# Altium schematic sheet Power_Supply_ZynqXC7Z010.SchDoc
size A4; SheetNumber: 5; SheetTotal: 5
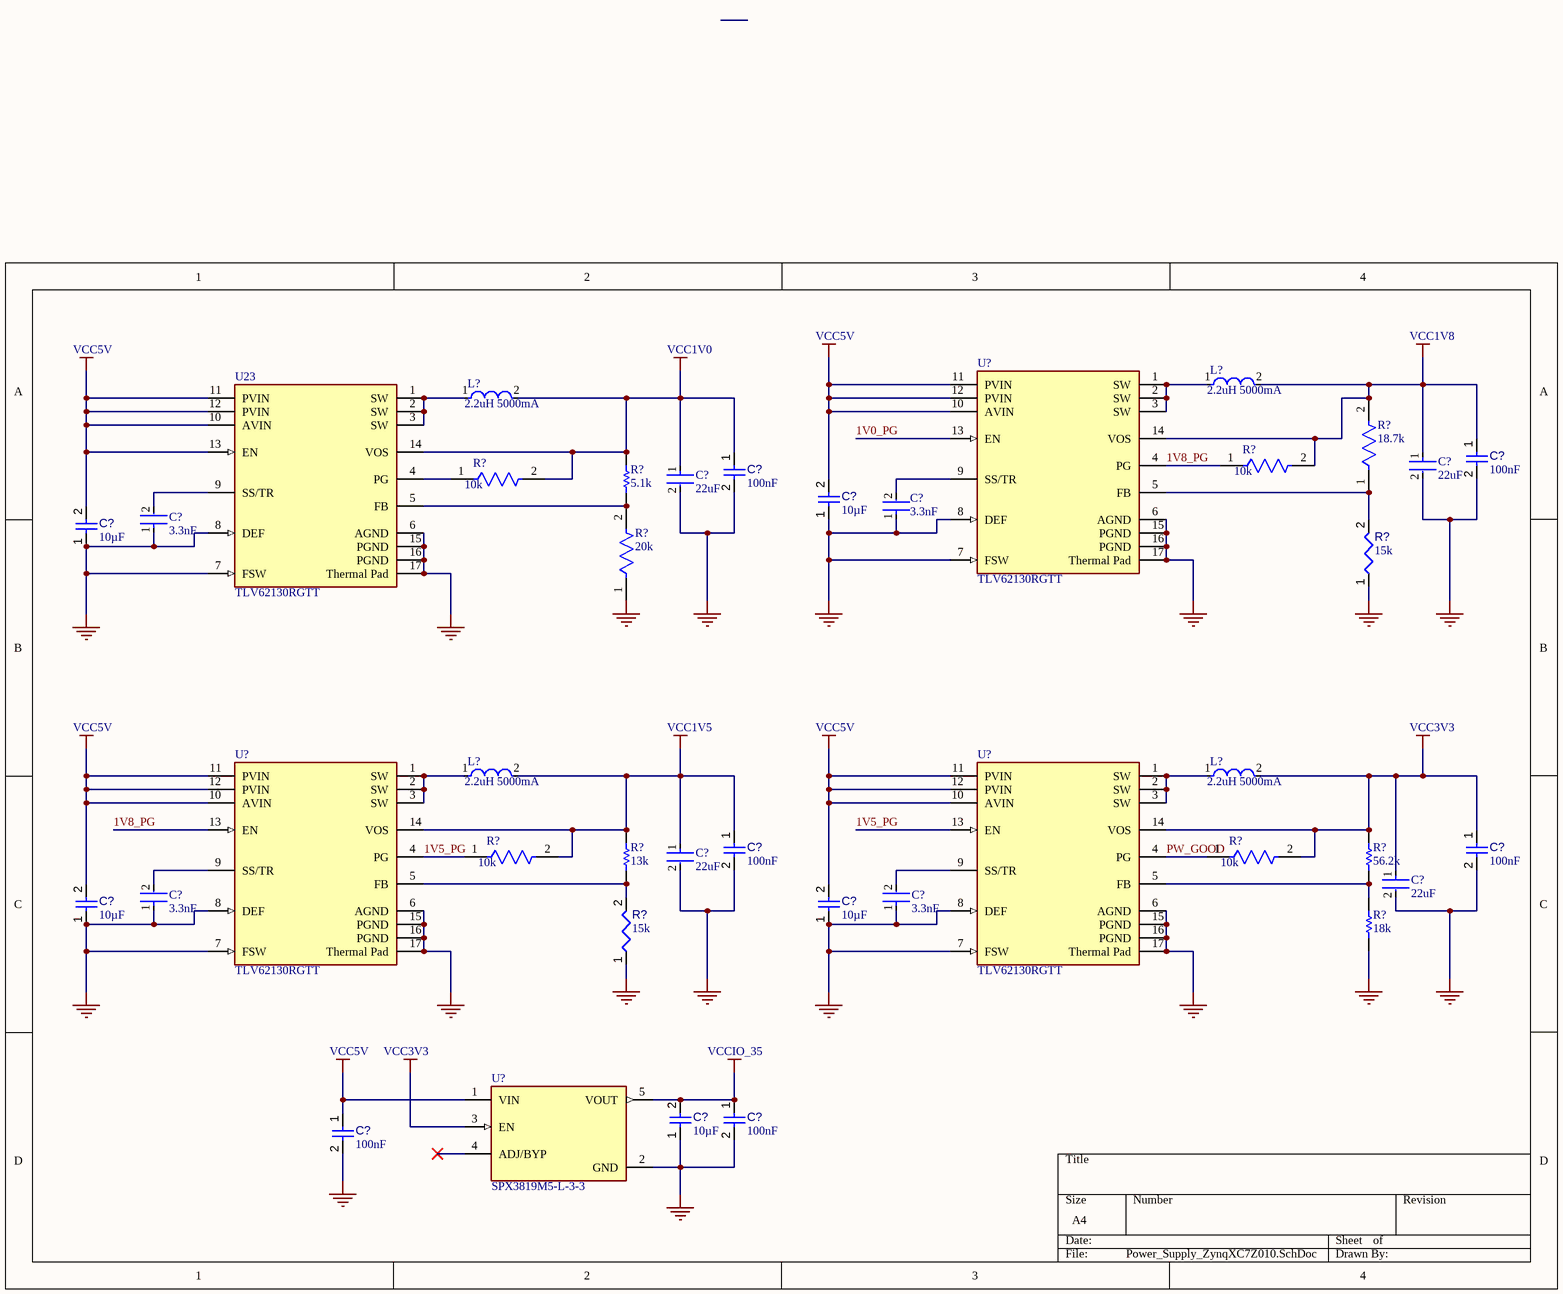
[diagram p0: Power_Supply_ZynqXC7Z010.SchDoc]

## Parts
(Parts that share a designator on the sheet are numbered #1, #2 ... from top to bottom, then left to right.)
C?#1  value 100nF  [CAPC1608X90X40NL10T20]  (hidden comment: Capacitor 100 nF +/-10% 50 V 0603)
C?#2  value 100nF  [CAPC1608X90X40NL10T20]  (hidden comment: Capacitor 100 nF +/-10% 50 V 0603)
C?#3  22uF  [FP-GRM21B-0_2-e0_2_0_7-IPC_C]
C?#4  22uF  [FP-GRM21B-0_2-e0_2_0_7-IPC_C]
C?#5  value 10µF  [CAPC2013X135X45NL10T25]  (hidden comment: Capacitor 10 uF +/- 10% 16 V 0805)
C?#6  3.3nF  [FP-CC0603-DA-MFG]
C?#7  3.3nF  [FP-CC0603-DA-MFG]
C?#8  value 10µF  [CAPC2013X135X45NL10T25]  (hidden comment: Capacitor 10 uF +/- 10% 16 V 0805)
C?#9  value 100nF  [CAPC1608X90X40NL10T20]  (hidden comment: Capacitor 100 nF +/-10% 50 V 0603)
C?#10  value 100nF  [CAPC1608X90X40NL10T20]  (hidden comment: Capacitor 100 nF +/-10% 50 V 0603)
C?#11  22uF  [FP-GRM21B-0_2-e0_2_0_7-IPC_C]
C?#12  22uF  [FP-GRM21B-0_2-e0_2_0_7-IPC_C]
C?#13  3.3nF  [FP-CC0603-DA-MFG]
C?#14  3.3nF  [FP-CC0603-DA-MFG]
C?#15  value 10µF  [CAPC2013X135X45NL10T25]  (hidden comment: Capacitor 10 uF +/- 10% 16 V 0805)
C?#16  value 10µF  [CAPC2013X135X45NL10T25]  (hidden comment: Capacitor 10 uF +/- 10% 16 V 0805)
C?#17  value 100nF  [CAPC1608X90X40NL10T20]  (hidden comment: Capacitor 100 nF +/-10% 50 V 0603)
C?#18  value 100nF  [CAPC1608X90X40NL10T20]  (hidden comment: Capacitor 100 nF +/-10% 50 V 0603)
C?#19  value 10µF  [CAPC2013X135X45NL10T25]  (hidden comment: Capacitor 10 uF +/- 10% 16 V 0805)
L?#1  2.2uH 5000mA  [FP-LQM2MPN_G0-MFG]
L?#2  2.2uH 5000mA  [FP-LQM2MPN_G0-MFG]
L?#3  2.2uH 5000mA  [FP-LQM2MPN_G0-MFG]
L?#4  2.2uH 5000mA  [FP-LQM2MPN_G0-MFG]
R?#1  10k  [FP-RC0603-0_55-IPC_C]
R?#2  10k  [FP-RC0603-0_55-IPC_C]
R?#3  5.1k  [RESC1608X55X25ML10T15]
R?#4  18.7k  [FP-CRCW0603-e3-IPC_C]
R?#5  value 15k  [RESC1005X40X25ML10T10]  (hidden comment: Resistor 15k +/-1% 0402 63 mW)
R?#6  20k  [FP-RC0603-0_55-IPC_C]
R?#7  10k  [FP-RC0603-0_55-IPC_C]
R?#8  10k  [FP-RC0603-0_55-IPC_C]
R?#9  13k  [RESC1608X55X25LL10T15]
R?#10  56.2k  [RESC1608X55X25LL10T15]
R?#11  18k  [RESC1608X55X25LL10T15]
R?#12  value 15k  [RESC1005X40X25ML10T10]  (hidden comment: Resistor 15k +/-1% 0402 63 mW)
U23  TLV62130RGTT  [FP-RGT0016C-IPC_C]
U?#1  TLV62130RGTT  [FP-RGT0016C-IPC_C]
U?#2  TLV62130RGTT  [FP-RGT0016C-IPC_C]
U?#3  TLV62130RGTT  [FP-RGT0016C-IPC_C]
U?#4  SPX3819M5-L-3-3  [SOT95P280X145-5N]

## Nets
GND: C?#1.2 C?#2.2 C?#3.2 C?#4.2 C?#5.1 C?#6.1 C?#7.1 C?#8.1 C?#9.2 C?#10.2 C?#11.2 C?#12.2 C?#13.1 C?#14.1 C?#15.1 C?#16.1 C?#17.2 C?#18.2 C?#19.1 R?#5.1 R?#6.1 R?#11.1 R?#12.1 U23.6(AGND) U23.7(FSW) U23.8(DEF) U23.15(PGND) U23.16(PGND) U23.17(Thermal_Pad) U?#1.6(AGND) U?#1.7(FSW) U?#1.8(DEF) U?#1.15(PGND) U?#1.16(PGND) U?#1.17(Thermal_Pad) U?#2.6(AGND) U?#2.7(FSW) U?#2.8(DEF) U?#2.15(PGND) U?#2.16(PGND) U?#2.17(Thermal_Pad) U?#3.6(AGND) U?#3.7(FSW) U?#3.8(DEF) U?#3.15(PGND) U?#3.16(PGND) U?#3.17(Thermal_Pad) U?#4.2(GND)
VCC: C?#1.1 C?#2.1 C?#3.1 C?#4.1 C?#5.2 C?#8.2 C?#9.1 C?#10.1 C?#11.1 C?#12.1 C?#15.2 C?#16.2 C?#17.1 C?#18.1 C?#19.2 L?#1.2 L?#2.2 L?#3.2 L?#4.2 R?#1.2 R?#2.2 R?#3.2 R?#4.2 R?#7.2 R?#8.2 R?#9.2 R?#10.2 U23.10(AVIN) U23.11(PVIN) U23.12(PVIN) U23.13(EN) U23.14(VOS) U?#1.10(AVIN) U?#1.11(PVIN) U?#1.12(PVIN) U?#1.14(VOS) U?#2.10(AVIN) U?#2.11(PVIN) U?#2.12(PVIN) U?#2.14(VOS) U?#3.10(AVIN) U?#3.11(PVIN) U?#3.12(PVIN) U?#3.14(VOS) U?#4.1(VIN) U?#4.3(EN) U?#4.5(VOUT)
1V0_PG: U?#1.13(EN)
1V5_PG: R?#7.1 U?#2.4(PG) U?#3.13(EN)
1V8_PG: R?#1.1 U?#1.4(PG) U?#2.13(EN)
PW_GOOD: R?#8.1 U?#3.4(PG)
NetC?#6_2: C?#6.2 U?#1.9(SS/TR)
NetC?#7_2: C?#7.2 U23.9(SS/TR)
NetC?#13_2: C?#13.2 U?#2.9(SS/TR)
NetC?#14_2: C?#14.2 U?#3.9(SS/TR)
NetL?#1_1: L?#1.1 U?#1.1(SW) U?#1.2(SW) U?#1.3(SW)
NetL?#2_1: L?#2.1 U23.1(SW) U23.2(SW) U23.3(SW)
NetL?#3_1: L?#3.1 U?#2.1(SW) U?#2.2(SW) U?#2.3(SW)
NetL?#4_1: L?#4.1 U?#3.1(SW) U?#3.2(SW) U?#3.3(SW)
NetR?#2_1: R?#2.1 U23.4(PG)
NetR?#3_1: R?#3.1 R?#6.2 U23.5(FB)
NetR?#4_1: R?#4.1 R?#5.2 U?#1.5(FB)
NetR?#9_1: R?#9.1 R?#12.2 U?#2.5(FB)
NetR?#10_1: R?#10.1 R?#11.2 U?#3.5(FB)

Not connected (* = marked no-connect by the designer): U?#4 4(ADJ/BYP)*

## Notes on the sheet
- VCC5V
- VCC1V0
- VCC1V8
- VCC1V5
- VCC3V3
- VCCIO_35

## Library data of the parts
C?#1 C?#2 C?#9 C?#10 C?#17 C?#18 = CMP-001-00017-6: Chip Capacitor, 100 nF, +/- 10%, 50 V, 0603 (1608 Metric); Voltage Rating: 50V; Capacitor Type: Ceramic; Tolerance: 10%; Mounting Technology: SM; Max Operating Temperature: 125°C; RoHS Compliant: True; Pins: 2; Case/Package: 0603; Min Operating Temperature: -55°C
C?#3 C?#4 C?#11 C?#12 = CMP-06035-039918-1: Chip Multilayer Ceramic Capacitors for General Purpose, 0805, 22uF, X5R, 15%, 20%, 10V; Dissipation Factor: 0.035%; Min Operating Temperature: -55°C; Voltage Rating (DC): 10V; Height: 1.25mm; Depth: 1.25mm; Max Operating Temperature: 85°C; Width: 1.25mm; Lead Free: Lead Free; Dielectric Material: Ceramic; Weight: 0.000335oz; Tolerance: 20%; Voltage Rating: 10V; Case Code (Metric): 2012; Termination: SMD/SMT; Length: 2mm; Thickness: 0.057inch; Case/Package: 0805; Packaging: Tape and Reel; Voltage: 10V; Case Code (Imperial): 0805; Resistor Type: Ceramic; Package Quantity: 3000; Mount: Surface Mount; Capacitance: 22uF; Dielectric: X5R
C?#5 C?#8 C?#15 C?#16 C?#19 = CMP-001-00015-6: Chip Capacitor, 10 uF, +/- 10%, 16 V, 0805 (2012 Metric); Voltage Rating: 16V; Capacitor Type: Ceramic; RoHS Compliant: True; Max Operating Temperature: 85°C; Min Operating Temperature: -55°C; Mounting Technology: SM; Tolerance: 10%; Case/Package: 0805; Pins: 2
C?#6 C?#7 C?#13 C?#14 = CMP-03422-000191-1: CAP CER 3300PF 50V X7R 0603; Manufacturer: YAGEO; Manufacturer Part Number: CC0603KRX7R9BB332; Tolerance: 0.1; Temperature Coefficient: 15%; Material: Ceramic; Device Class L3: Ceramic Capacitors; Category: Cap; ComponentLink2URL: http://www.yageo.com/documents/recent/UPY-GPHC_X7R_6.3V-to-50V_18.pdf; Temperature: -55°C to +125°C; Voltage Rating: 50 V; Mouser Description: Multilayer Ceramic Capacitors MLCC - SMD/SMT 3.3nF 50V X7R 10%; Value: 3.3 nF; RoHS: TRUE; Temperature Range High: +125°C; Octopart: https://octopart.com/cc0603krx7r9bb332-yageo-39467719; Height: 0.9mm; Voltage: 50 V; ComponentLink2Description: Datasheet; Capacitance: 3.3 nF; Package: CC0603-DA; Device Class L1: Passive Components; Lead Free: Yes; Temperature Range Low: -55°C; Digikey Description: CAP CER 3300PF 50V X7R 0603; Device Class L2: Capacitors; Footprint Url: http://www.yageo.com/exep/pages/download/literatures/UPY-C_GEN_24.pdf; Automotive: No; Temperature Characteristic: X7R
L?#1-L?#4 = CMP-06042-016770-1: Multilayer Type Inductor for Power Lines, 0806 (2016), 2.2μH, 30%, 0.138Ω, 1.2A; Shielding: Shielded; Test Frequency: 1MHz; DC Resistance (DCR): 138mR; Core Material: Ferrite; Self Resonant Frequency: 40MHz; Packaging: Tape and Reel; Mount: Surface Mount; Package Quantity: 1; Case Code (Imperial): 0806; Width: 0.063inch; DC Current: 1.2A; Min Operating Temperature: -55°C; Radiation Hardening: No; Tolerance: 30%; RoHS Compliant: Yes; Case/Package: 0806; Lead Free: Lead Free; Height - Seated (Max): 0.039inch; Max Operating Temperature: 125°C; Series: LQM2MPN_G0; Height: 1mm; Inductance Tolerance: 30%; Length: 0.079inch; Case Code (Metric): 2016; Inductance: 2.2uH; Military Standard: Not; Depth: 1.75mm; Termination: SMD/SMT; Max DC Current: 1.2A; REACH SVHC: No SVHC; Current Rating: 1.2A
R?#1 R?#2 R?#7 R?#8 = CMP-2100-03664-2: RES 10K OHM 1% 1/10W 0603; Voltage Rating: 75V; Voltage Rating (DC): 50V; Resistance: 10kR; Power Rating: 100mW; Temperature Coefficient: 100ppm/°C; Depth: 0.8mm; Termination: SMD/SMT; Resistor Type: Thick Film; Series: RC; Construction: Rectangular; Features: Moisture Resistant; Packaging: Tape and Reel; Min Operating Temperature: -55°C; Number of Terminations: 2; Lead Pitch: 0.3mm; RoHS Compliant: Yes; Case/Package: 0603; Resistance Tolerance: 1%; Military Standard: Not; Weight: 7.1E-05oz; Number of Pins: 2; Tolerance: 1%; Length: 1.6mm; Case Code (Imperial): 0603; Lead Free: Lead Free; Width: 0.8mm; Max Power Dissipation: 100mW; Height: 0.45mm; Max Operating Temperature: 155°C; Case Code (Metric): 1608; Size Code: 0603
R?#3 = CMP-2000-04091-1: Manufacturer: Yageo; Part Number: RC0603FR-075K1L
R?#4 = CMP-2000-02962-2: RES Thick Film, 18.7kΩ, 1%, 0.1W, 100ppm/°C, 0603; Working Voltage: 75V; Resistance: 18.7kR; Power Rating: 100mW; Weight: 7.1E-05oz; Number of Terminations: 2; Number of Pins: 2; Temperature Coefficient: 100ppm/°C; Min Operating Temperature: -55°C; Max Operating Temperature: 155°C; Width: 0.85mm; Lead Free: Lead Free; Case/Package: 0603; Voltage Rating (DC): 75V; Features: Automotive AEC-Q200; Case Code (Metric): 1608; Packaging: Tape and Reel; Depth: 0.85mm; Voltage Rating: 75V; Length: 1.55mm; Case Code (Imperial): 0603; Contact Plating: Tin; Composition: Thick Film; Package Quantity: 10; Termination: SMD/SMT; Radiation Hardening: No; Tolerance: 1%; Military Standard: Not; Max Power Dissipation: 100mW; Height: 0.45mm
R?#5 R?#12 = CMP-009-00026-5: Chip Resistor, 15 KOhm, +/- 1%, 0.063 W, -55 to 155 degC, 0402 (1005 Metric); Power: 63mW; Min Operating Temperature: -55°C; Tolerance: 1%; Max Operating Temperature: 155°C; Mounting Technology: SM; Case/Package: 0402; RoHS Compliant: True; Pins: 2
R?#6 = CMP-2000-06932-2: RES 20K OHM 1% 1/10W 0603; Voltage Rating: 50V; Temperature Coefficient: 100ppm/°C; Power Rating: 100mW; Resistance: 20kR; Height: 0.022inch; REACH SVHC: No SVHC; Case Code (Metric): 1608; Depth: 0.8mm; Tolerance: 1%; Min Operating Temperature: -55°C; Series: RC; RoHS Compliant: Yes; Resistor Type: Thick Film; Max Power Dissipation: 100mW; Features: Moisture Resistant; Max Operating Temperature: 155°C; Package Quantity: 1; Size Code: 0603; Packaging: Tape and Reel; Width: 0.031inch; Length: 0.063inch; Military Standard: Not; Technology: THICK FILM; Number of Terminations: 2; Termination: SMD/SMT; Construction: Rectangular; Case/Package: 0603; Number of Pins: 2; Lead Free: Lead Free; Voltage Rating (DC): 50V; Resistance Tolerance: 1%; Case Code (Imperial): 0603
R?#9 = CMP-2000-06927-1: Chip Resistor, 13 KOhm, +/- 1%, 0.1 W, -55 to 155 degC, 0603 (1608 Metric), RoHS, Tape and Reel; Manufacturer: Yageo; Resistance: 13kOhms; Temperature Coefficient: 100PPM/C; Voltage Rating: 50V; Power Rating: 100mW; Packaging: Reel; Case Code - mm: 1608; Manufacturer URL: http://www.yageo.com/; Tolerance: 1%; Product: ThickFilmResistorsGeneralPurpose; Datasheet URL: http://www.yageo.com/documents/recent/PYu-RC_Group_51_RoHS_L_7.pdf; Package Reference: 0603; Operating Temperature Range: -55Cto+155C; Package Description: 2-Pin Surface Mount Device, Body 1.6 x 0.8 mm; Termination Style: SMD/SMT; Series: RC; Case Code - in: 0603; Datasheet Version: Rev. 7, 05/2017; Mounting Technology: SurfaceMount
R?#10 = CMP-1659-00050-1: Chip Resistor, 56.2 KOhm, +/- 1%, 0.1 W, -55 to 155 degC, 0603 (1608 Metric), RoHS, Tape and Reel; Gender: Female; Connector Type: USB; Voltage Rating: 30 V; Current Rating: 1 A; Packaging: Tray; Package Quantity: 24000; PackageDescription: 2-Pin Surface Mount Device, Body 1.6 x 0.8 mm; DatasheetVersion: Rev. 4, 02/2016; PackageReference: 0603; Length: 14.5 mm; Contact Material: Copper; ComponentLink2Description: Datasheet; Radiation Hardening: No; Max Operating Temperature: 50 degC; Width: 7.12 mm; RoHSCompliant: true; Contact Plating: Gold; Pins: 4; Colour: Black; ComponentLink1Description: Manufacturer URL; Min Operating Temperature: 0 degC; ComponentLink2URL: http://www.yageo.com/documents/recent/PYu-RC_Group_51_RoHS_L_04.pdf; Height: 15 mm; ComponentLink1URL: http://www.yageo.com/; Mount: Through Hole; REACH SVHC: Unknown
R?#11 = CMP-2000-06930-1: Chip Resistor, 18 KOhm, +/- 1%, 0.1 W, -55 to 155 degC, 0603 (1608 Metric), RoHS, Tape and Reel; Manufacturer: Yageo; Voltage Rating: 75V; Temperature Coefficient: 100PPM/C; Unit Weight: 0.000071oz; Power Rating: 100mW; Resistance: 18kOhms; Datasheet URL: http://www.yageo.com/documents/recent/PYu-RC_Group_51_RoHS_L_7.pdf; Packaging: Reel; Series: RC; Datasheet Version: Rev. 7, 05/2017; Type: GeneralPurposeChipResistorSurfaceMount; Termination Style: SMD/SMT; Package Reference: 0603; Operating Temperature Range: -55Cto+155C; Mounting Technology: SurfaceMount; Tolerance: 1%; Height: 0.45mm; Length: 1.6mm; Case Code - mm: 1608; Product: ThickFilmResistorsGeneralPurpose; RoHS: True; Product Category: ThickFilmResistors; Case Code - in: 0603; Brand: Yageo; Manufacturer URL: http://www.yageo.com/; Width: 0.8mm; Package / Case: 0603(1608metric); Package Description: 2-Pin Surface Mount Device, Body 1.6 x 0.8 mm
U23 U?#1-U?#3 = CMP-04918-000305-1: IC REG BUCK ADJUSTABLE 3A 16QFN; Output Configuration: Positive; Synchronous Rectifier: Yes; Min Input Voltage: 4V; Max Output Voltage: 5V; Operating Supply Current: 19uA; Min Output Voltage: 900mV; Switching Frequency: 2.5MHz; Number of Outputs: 1; Max Input Voltage: 17V; Length: 3.15mm; Height: 0.95mm; Series: DCS-Control™; Min Operating Temperature: -40°C; Weight: 0.001623oz; Contact Plating: Gold; Max Output Current: 3A; Output Current: 3A; Mount: Surface Mount; Output Voltage: 5V; Lead Free: Lead Free; Packaging: Tape and Reel; Quiescent Current: 19uA; Radiation Hardening: No; Case/Package: QFN; Min Supply Voltage: 4V; REACH SVHC: No SVHC; Max Operating Temperature: 85°C; RoHS Compliant: Yes; Output Type: Adjustable; Package Quantity: 250; Number of Pins: 16; Width: 3.15mm
U?#4 = CMP-031-00008-1: Linear Voltage Regulator IC Positive Fixed 1 Output 500mA SOT-23-5; MP: SPX3819M5-L-3-3/TR; MF: MaxLinear, Inc.; Component Type: Standard; Design Item ID: SPX3819M5-L-3-3; Value: *; Pins: 5; Source: SPX3819M5-L-3-3.SchLib; Case/Package: SOT-23-5 Exar; Check_prices: https://www.snapeda.com/parts/SPX3819M5-L-3-3/TR/MaxLinear%252C+Inc./view-part/?ref=eda; SnapEDA_Link: https://www.snapeda.com/parts/SPX3819M5-L-3-3/TR/MaxLinear%252C+Inc./view-part/?ref=snap